# EasyEDA Pro project 遥控关灯接收(433).eprj

# Schematic Schematic1

## Sheets
1 电源: Create Date: 2022-12-05; Page Name: 电源; Project Name: 遥控关灯接收(433); Schematic Name: Schematic1; Update Date: 2022-12-05; Company: 嘉立创EDA; Page Size: A4; Version: V1.0
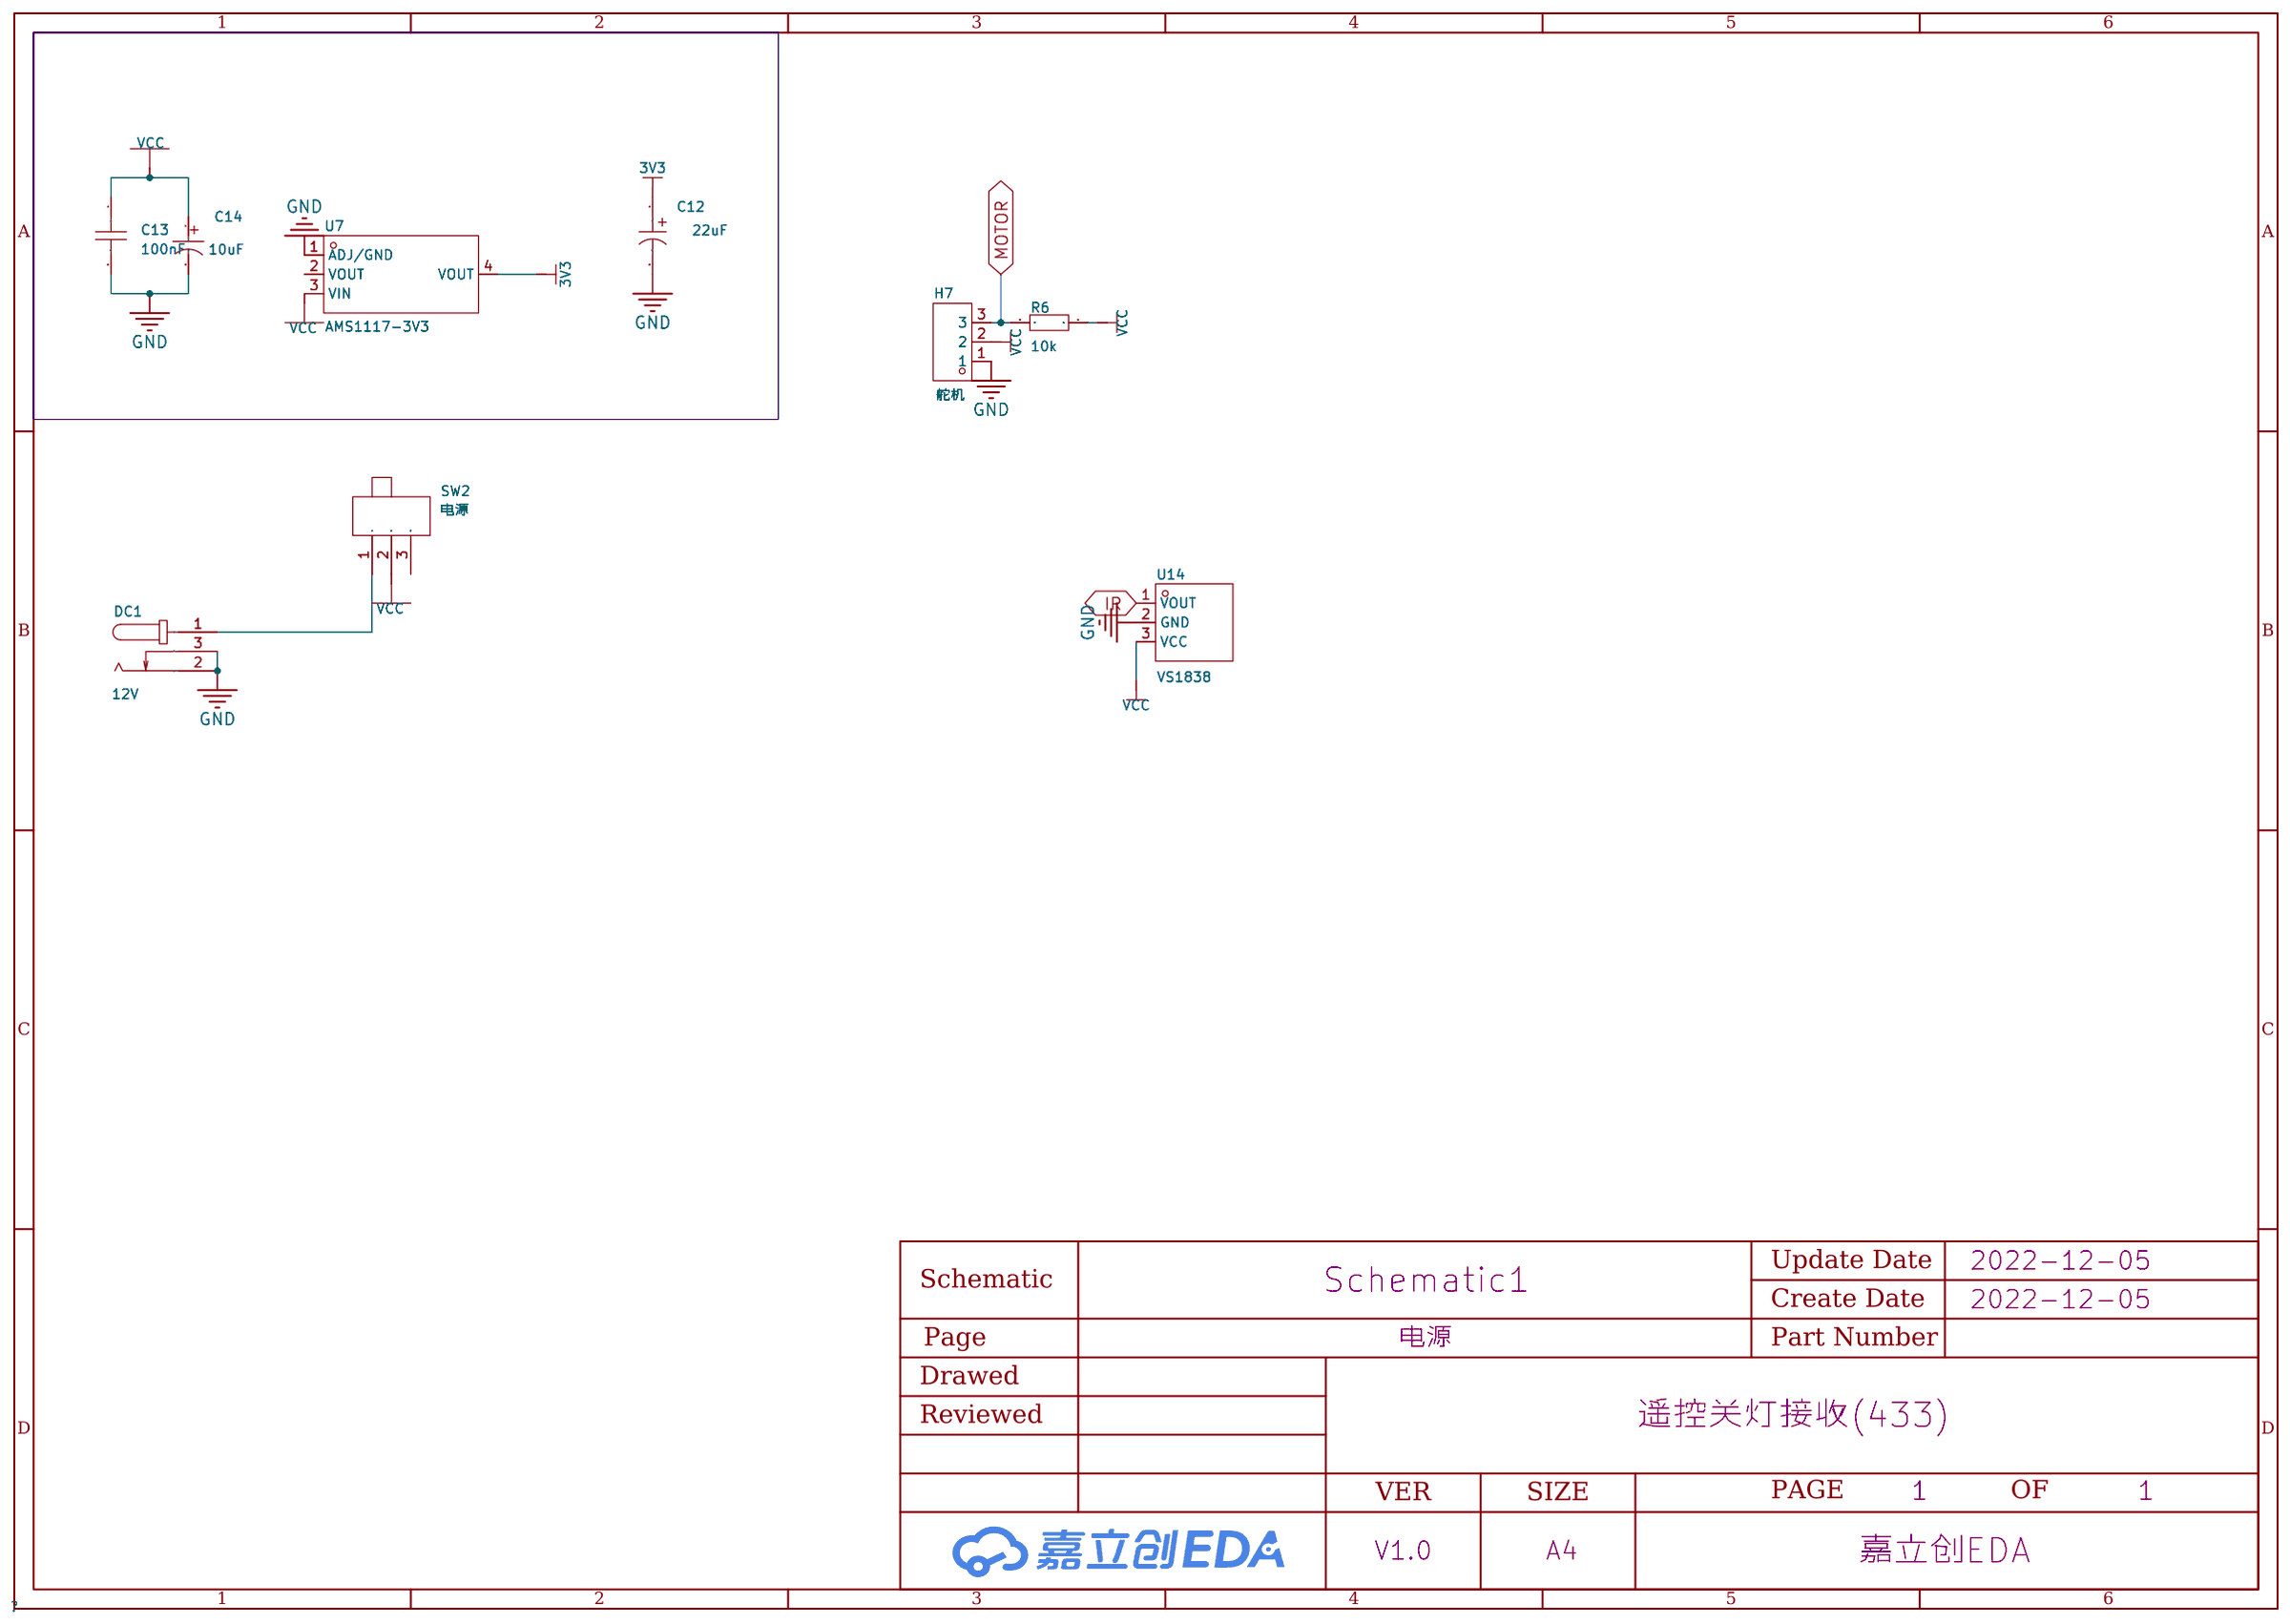
[diagram p0: 电源]
2 433接收: Page Name: 433接收
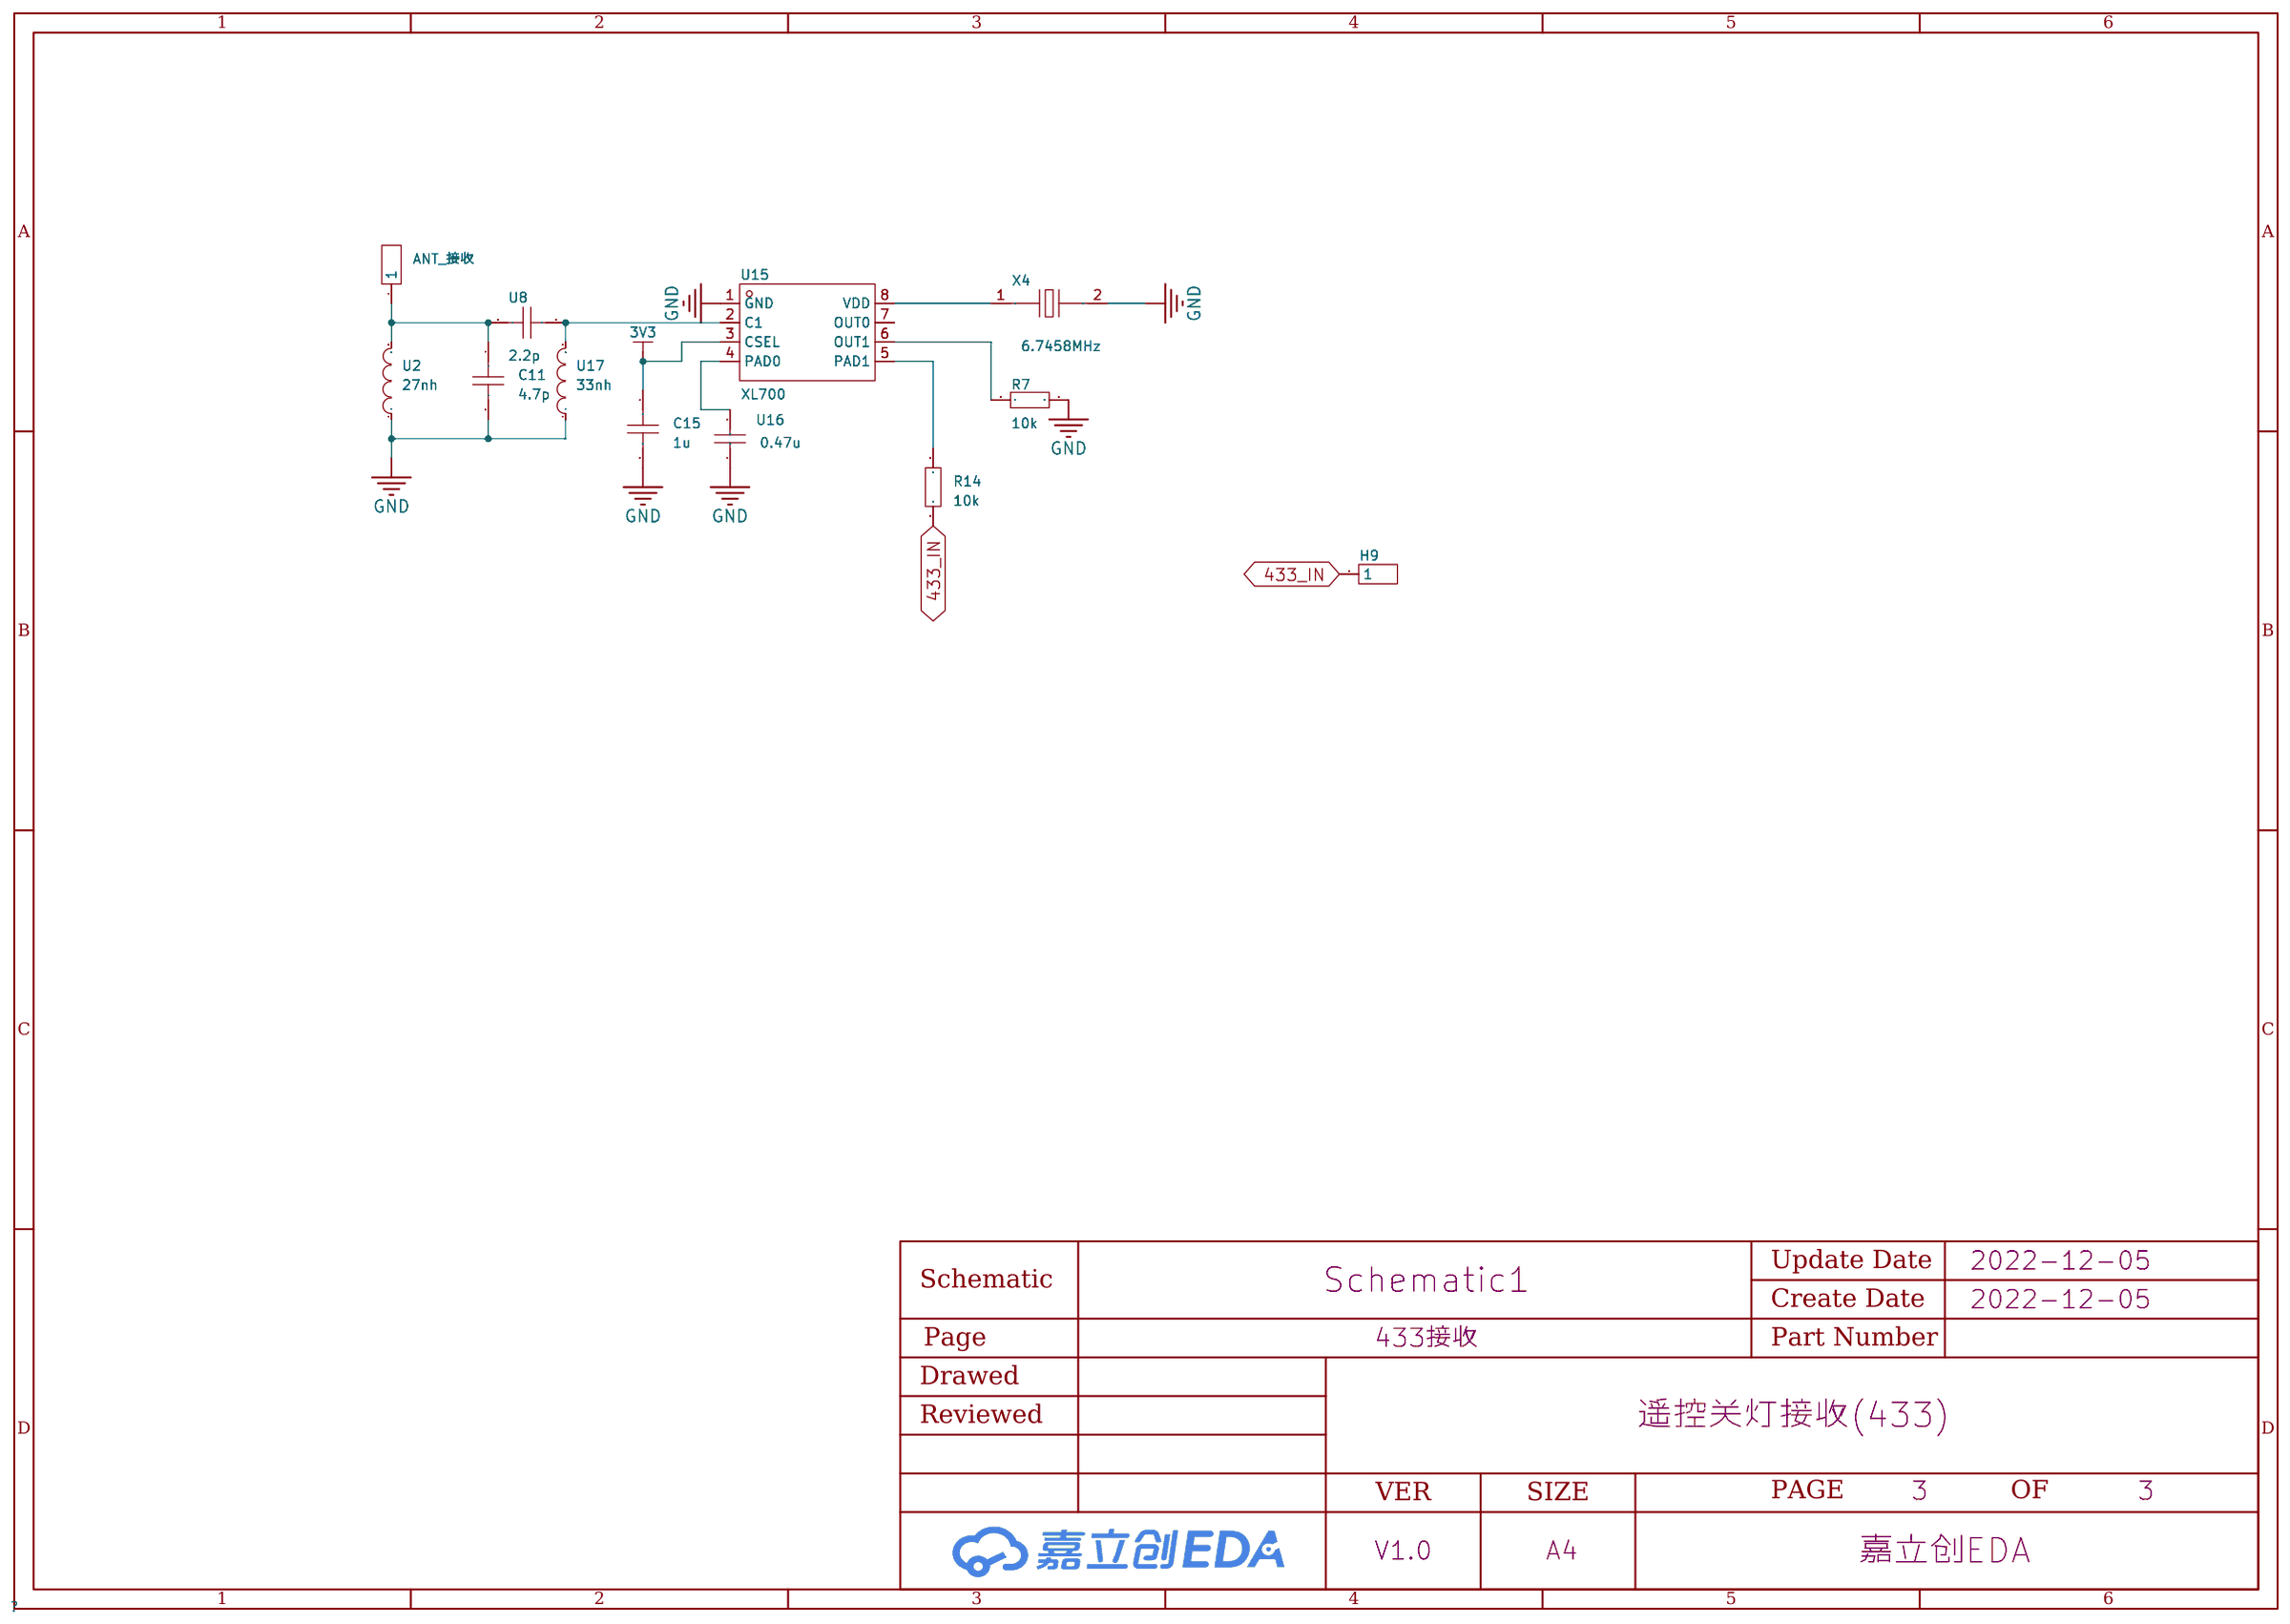
[diagram p1: 433接收]
3 stm32: Page Name: stm32
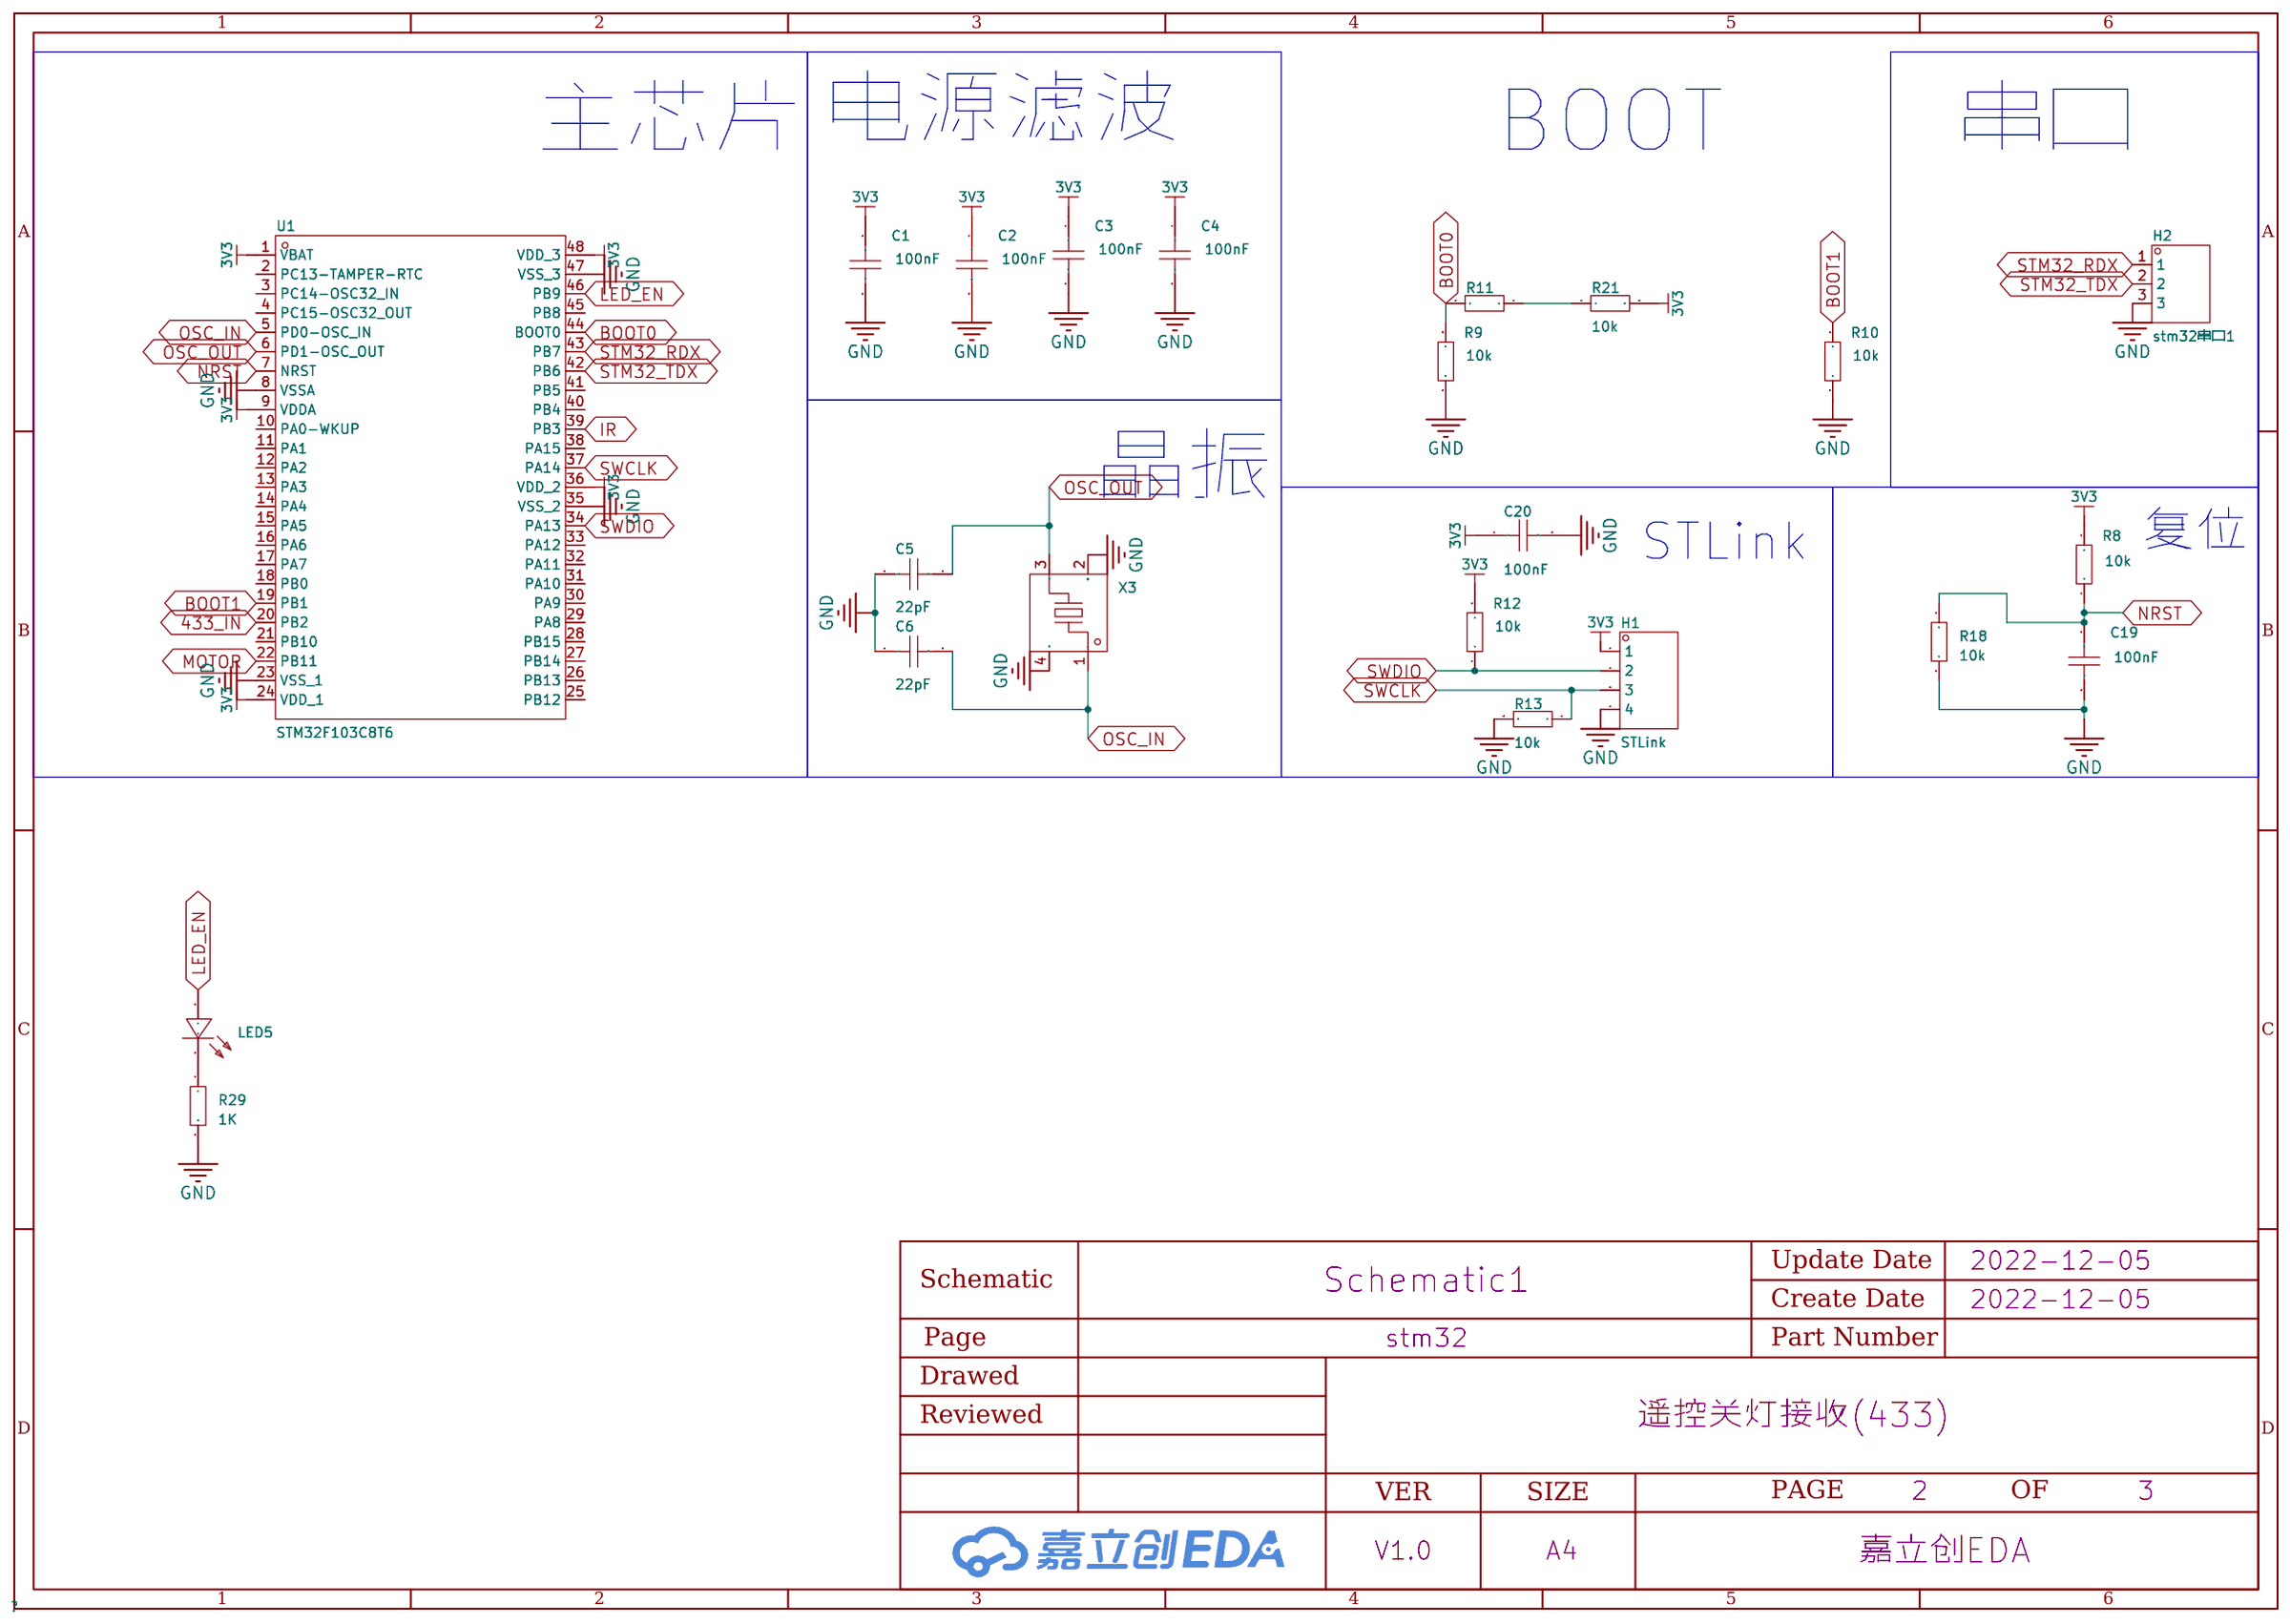
[diagram p2: stm32]

## Parts
sheet 433接收
ANT_接收  -  [HDR-TH_1P-V-M_XKB_X4611WV-01I-C28D40]
C11  4.7p  [C0805]
C15  1u  [C0805]
H9  -  [HDR-TH_1P-V-M_XKB_X4611WV-01I-C28D40]
R7  10k  [R0805]
R14  10k  [R0805]
U2  27nh  [L0603]
U8  2.2p  [C0603]
U15  XL700  [SOP-8_L4.9-W3.9-P1.27-LS6.0-BL]
U16  0.47u  [C0402]
U17  33nh  [L0603]
X4  -  [OSC-SMD_2P-L11.4-W4.7-LS12.3]
sheet stm32
C1  100nF  [C0805]
C2  100nF  [C0805]
C3  100nF  [C0805]
C4  100nF  [C0805]
C5  22pF  [C0805]
C6  22pF  [C0805]
C19  100nF  [C0805]
C20  100nF  [C0805]
H1  STLink  [HDR-TH_4P-P2.54-V-M]
H2  stm32串口1  [HDR-TH_3P-P2.54-V-M-1]
LED5  -  [LED0805-R-RD]
R8  10k  [R0805]
R9  10k  [R0805]
R10  10k  [R0805]
R11  100R  [R0805]
R12  10k  [R0805]
R13  10k  [R0805]
R18  10k  [R0805]
R21  10k  [R0805]
R29  1K  [R0805]
U1  STM32F103C8T6  [LQFP-48_L7.0-W7.0-P0.50-LS9.0-BL]
X3  NX3225SA-26MHz-STD-CSR-6  [CRYSTAL-SMD_4P-L3.2-W2.5-BL]
sheet 电源
C12  22uF  [CAP-TH_BD5.0-P2.00-D0.6-FD]
C13  100nF  [C0805]
C14  10uF  [CAP-TH_BD5.0-P2.00-D0.8-FD]
DC1  12V  [DC-IN-TH_DC005-T20]
H7  舵机  [HDR-TH_3P-P2.54-V-F]
R6  10k  [R0805]
SW2  电源  [SW-TH_MK-12D18-G040]
U7  AMS1117-3V3  [SOT-223-3_L6.7-W3.7-P2.30-LS7.0-BR]
U14  VS1838  [OPTO-TH_3P-L7.0-W5.6-P2.54-L]

## Library data of the parts
ANT_接收 H9 = HDR-M_2.54_1x1P: Supplier Part: C81276; Supplier Footprint: 插件; JLCPCB Part Class: Extended Part
C1-C6 C11 C13 C15 C19 C20 = 0805: Supplier Part: C9900012713; JLCPCB Part Class: Extended Part; Datasheet: https://atta.szlcsc.comnull; Supplier: LCSC
R6-R14 R18 R21 R29 = 0805: Supplier Part: C9900012715; JLCPCB Part Class: Extended Part; Datasheet: https://atta.szlcsc.comnull; Supplier: LCSC
U2 U17 = 1.3nH±10%: Supplier Part: C9900010244; JLCPCB Part Class: Extended Part; Datasheet: https://atta.szlcsc.comnull; Supplier: LCSC
U8 = 104P: Supplier Part: C9900009971; JLCPCB Part Class: Extended Part; Datasheet: https://atta.szlcsc.comnull; Supplier: LCSC
U15 = XW02E SOP8: 触摸芯片  XW02E SOP8 两通道触摸感应芯片 ,低功耗 强抗干扰 ；长按时间可达到30分钟； 可以抗ESD8000V 动态cs10v EFT4000V的测试 ；容易通过 EMC 测试; 唤醒时间0.2s，广泛应用于脱毛仪、铲皮刀等美容产品，筋膜枪，雾化器，加湿器，直饮机，水平仪 、咖啡机、 速热机等各类电源干扰大的产品-（不误动作）; LCSC Part Name: 触摸芯片; Supplier Part: C5156897; Manufacturer: Sam&wing(芯网); Supplier Footprint: SOP-8; Datasheet: https://atta.szlcsc.com/upload/public/pdf/source/20221018/6033144A9FF62F478D7EFEAD640D9693.pdf; Supplier: LCSC
U16 = 16p: Supplier Part: C9900003759; JLCPCB Part Class: Extended Part; Datasheet: https://atta.szlcsc.comnull; Supplier: LCSC
X4 = 49SMD-4MHZ-15PF-20PPM: 晶振类型:-;频率:-;负载电容:-;工作温度:-;; Supplier Part: C337676; Manufacturer: TKD(泰晶); Supplier Footprint: HC-49S-SMD-2P; JLCPCB Part Class: Extended Part; Datasheet: https://atta.szlcsc.com/upload/public/pdf/source/20190802/C337676_755A2B85AE73FBC05217DA61C6B0E5FE.pdf; Supplier: LCSC
H1 = B-2100S04P-A110: 间距:2.54mm;总PIN位数:4;排数:1;插针结构:1x4P;行距:-;安装类型:直插;圆针/方针:-;额定电流:-;额定电压:-;配合针长度:6mm;塑高:2.54mm;端接针长度:3mm;触头材质:黄铜;触头镀层:-;工作温度范围:-40~+105;颜色:黑色;; LCSC Part Name: 2.54mm 1x4P; Supplier Part: C124378; Manufacturer: Ckmtw(灿科盟); Supplier Footprint: 插件,P=2.54mm; JLCPCB Part Class: Extended Part; Datasheet: https://atta.szlcsc.com/upload/public/pdf/source/20170821/C124378_1503303307508901532.pdf; Supplier: LCSC; Pitch: 2.54mm; Number of Pins: 4; Number of Rows: 1; Pin Structure: 1x4P; Mounting Type: 直插; Length of Mating Pin: 6mm; Insulation Height: 2.54mm; Length of End Connection Pin: 3mm; Contact Material: 黄铜; Operating Temperature Range: -40~+105; Color: 黑色
H2 = 77311-102-03LF: 间距:2.54mm;总PIN位数:3;排数:1;插针结构:-;行距:-;安装类型:直插;圆针/方针:-;额定电流:-;额定电压:-;配合针长度:-;塑高:-;触头材质:磷青铜;触头镀层:-;颜色:黑色;; LCSC Part Name: 2.54mm; Supplier Part: C180248; Manufacturer: Amphenol; Supplier Footprint: 插件,P=2.54mm; JLCPCB Part Class: Extended Part; Datasheet: https://atta.szlcsc.com/upload/public/pdf/source/20180329/C180248_62E264527695F7ED58561BB828D45E42.pdf; Supplier: LCSC; Pitch: 2.54mm; Number of Pins: 3; Number of Rows: 1; Mounting Type: 直插; Contact Material: 磷青铜; Color: 黑色
LED5 = NCD0805G1: 发光颜色:翠绿;; LCSC Part Name: 翠绿; Supplier Part: C84260; Manufacturer: 国星光电; Supplier Footprint: 0805; JLCPCB Part Class: Extended Part; Datasheet: https://atta.szlcsc.com/upload/public/pdf/source/20200820/C84260_AFC7BF57C6FBA034D182BB8D10A67EFE.pdf; Supplier: LCSC; Emitted Color: 翠绿
U1 = STM32F103C8T6: CPU位数:32-Bit;ROM类型:FLASH;CPU内核:ARM® Cortex®-M3;主频（MAX):72MHz;工作电压:2V ~ 3.6V;; LCSC Part Name: STM32F103C8T6 MSL=3; Supplier Part: C8734; Manufacturer: ST(意法半导体); Supplier Footprint: LQFP-48_7x7x05P; JLCPCB Part Class: Basic Part; Datasheet: https://atta.szlcsc.com/upload/public/pdf/source/20140724/1457707174202.pdf; Supplier: LCSC; Core Size: 32-Bit; Program Memory Type: FLASH; Core Processor: ARM® Cortex®-M3; Speed: 72MHz; Voltage - Supply (Vcc/Vdd): 2V ~ 3.6V; Program Memory Size: 64KB; RAM Size: 20KB; Number of I/O: 37; A/D: 10x12bit; D/A: 0; PWM: 13; LCD: 0; UART/USART: 3 USART; SPI: 2; I2C（SMBUS/PMBUS）: 2; USB Device: 1; CAN: 1; Ethernet: 0
X3 = NX3225SA-26MHz-STD-CSR-6: LCSC Part Name: NX3225SA 26MHz 8pF ±15ppm ?40 to +85 °C; Supplier Part: C880099; Manufacturer: NDK; Supplier Footprint: 3225; JLCPCB Part Class: Extended Part; Datasheet: https://atta.szlcsc.com/upload/public/pdf/source/20171201/C156252_15121213466341157580.pdf; Supplier: LCSC
C12 = LW220M0500511PV2-D5: LCSC Part Name: 22uF 50V; Supplier Part: C2847230; Manufacturer: UNITED(怡德); Supplier Footprint: 径向引线,5x11mm; JLCPCB Part Class: Extended Part; Datasheet: https://atta.szlcsc.com/upload/public/pdf/source/20210723/C2847230_6E41DE0F8E72341694F7D9843C90A4AD.pdf; Supplier: LCSC
C14 = KM106M025D11RR0VH2FP0: 脚间距:2mm;额定电压:25V;纹波电流:38mA 120Hz;等效串联电阻:-;精度:±20%;电容体直径:5mm;工作温度:-;电容体长度:11mm;容值:10uF;工作寿命:1000hrs 105;; LCSC Part Name: 10uF 25V; Supplier Part: C43347; Manufacturer: CX(承兴); Supplier Footprint: 径向引线,5x11mm; JLCPCB Part Class: Extended Part; Datasheet: https://atta.szlcsc.com/upload/public/pdf/source/20151029/1457707524171.pdf; Supplier: LCSC; Lead Spacing: 2mm; Rated Voltage: 25V; Ripple Current: 38mA 120Hz; Tolerance: ±20%; φD: 5mm; L: 11mm; Lifetime @ Temp: 1000hrs 105
DC1 = DC005-T20: 连接器类型:DC电源插座;安装方式:弯插;触点内径:-;触点外径:6.3mm;额定电流:3A;额定电压:30V;工作温度范围:-10~+60;; LCSC Part Name: 外径:6.3mm B级 全铜; Supplier Part: C111567; Manufacturer: SOFNG(硕方); Supplier Footprint: 插件; JLCPCB Part Class: Extended Part; Datasheet: https://atta.szlcsc.com/upload/public/pdf/source/20170519/1495157966733.pdf; Supplier: LCSC; Connector Type: DC电源插座; Mounting Style: 弯插; Outside Contact Diameter: 6.3mm; Current Rating (Max): 3A; Voltage Rating (Max): 30V; Operating Temperature Range: -10~+60
H7 = HDR-F_2.54_1x3P: Supplier Part: C541850; Supplier Footprint: 插件
SW2 = MK-12D18-G020: LCSC Part Name: 边三脚微型拨动开关G4; Supplier Part: C3019727; Manufacturer: G-Switch(品赞); Supplier Footprint: 插件; JLCPCB Part Class: Extended Part; Datasheet: https://atta.szlcsc.com/upload/public/pdf/source/20201201/C963202_825FB742C5BA766BED52E1DDA96DE5A3.pdf; Supplier: LCSC
U7 = AMS1117-5.0: 静态电流(Iq):-;输出类型:固定;最大输入电压:18V;输出电压(可调):-;压降(max):1.5V @ 1A;输出电压(固定):5V;; Supplier Part: C473812; Manufacturer: Slkor(萨科微); Supplier Footprint: SOT-223; JLCPCB Part Class: Extended Part; Datasheet: https://atta.szlcsc.com/upload/public/pdf/source/20201231/C426566_7F22DB93439D00F3FA27143E4F28C6AA.pdf; Supplier: LCSC; Output Configuration: 正; Current - Supply (Max): 5mA; Output Current (Max): 1.4A; Output Type: 固定; Number of Output Channels: 1; Voltage - Input (Max): 18V; Operating Temperature: -40~85; Voltage Dropout (Max): 1.5V @ 1A; Voltage - Output (Fixed): 5V
U14 = DY-IRM-AC01-AN: LCSC Part Name: 38K解码接收头; Supplier Part: C2759912; Manufacturer: TONYU(东裕); Supplier Footprint: 插件; JLCPCB Part Class: Extended Part; Datasheet: https://atta.szlcsc.com/upload/public/pdf/source/20210319/C2759912_32410E2E7FB9BD2506BF27C3C0537725.pdf; Supplier: LCSC

## Nets
3V3: C1.1 C2.1 C3.1 C4.1 C12.1 C15.1 C20.1 H1.1 R8.2 R12.2 R21.2 U1.1(VBAT) U1.9(VDDA) U1.24(VDD_1) U1.36(VDD_2) U1.48(VDD_3) U7.4(VOUT) U15.3(CSEL)
GND: C1.2 C2.2 C3.2 C4.2 C5.1 C6.1 C11.2 C12.2 C13.2 C14.2 C15.2 C19.2 C20.2 DC1.2 DC1.3 H1.4 H2.3 H7.1 R7.1 R9.1 R10.1 R13.2 R18.2 R29.2 U1.8(VSSA) U1.23(VSS_1) U1.35(VSS_2) U1.47(VSS_3) U2.1 U7.1(ADJ/GND) U14.2(GND) U15.1(GND) U16.1 U17.1 X3.2(GND) X3.4(GND) X4.2
VCC: C13.1 C14.1 H7.2 R6.1 SW2.2 U7.3(VIN) U14.3(VCC)
433_IN: H9.1 R14.2 U1.20(PB2)
BOOT0: R9.2 R11.2 U1.44(BOOT0)
BOOT1: R10.2 U1.19(PB1)
IR: U1.39(PB3) U14.1(VOUT)
LED_EN: LED5.1(A) U1.46(PB9)
MOTOR: H7.3 R6.2 U1.22(PB11)
NRST: C19.1 R8.1 R18.1 U1.7(NRST)
OSC_IN: C6.2 U1.5(PD0-OSC_IN) X3.1
OSC_OUT: C5.2 U1.6(PD1-OSC_OUT) X3.3
STM32_RDX: H2.1 U1.43(PB7)
STM32_TDX: H2.2 U1.42(PB6)
SWCLK: H1.3 R13.1 U1.37(PA14)
SWDIO: H1.2 R12.1 U1.34(PA13)
$1N824: DC1.1 SW2.1
$2N627: ANT_接收.1 C11.1 U2.2 U8.2
$2N630: U8.1 U15.2(C1) U17.2
$2N631: U15.8(VDD) X4.1
$2N635: R7.2 U15.6(OUT1)
$2N636: R14.1 U15.5(PAD1)
$2N638: U15.4(PAD0) U16.2
$3N3616: LED5.2(K) R29.1
Net-(R11-1): R11.1 R21.1

Not connected (* = marked no-connect by the designer): SW2 3; U1 2(PC13-TAMPER-RTC) 3(PC14-OSC32_IN) 4(PC15-OSC32_OUT) 10(PA0-WKUP) 11(PA1) 12(PA2) 13(PA3) 14(PA4) 15(PA5) 16(PA6) 17(PA7) 18(PB0) 21(PB10) 25(PB12) 26(PB13) 27(PB14) 28(PB15) 29(PA8) 30(PA9) 31(PA10) 32(PA11) 33(PA12) 38(PA15) 40(PB4) 41(PB5) 45(PB8); U7 2(VOUT); U15 7(OUT0)

## Notes on the sheets
sheet 3
- 主芯片
- 电源滤波
- BOOT
- 串口
- 晶振
- STLink
- 复位

# Board PCB1
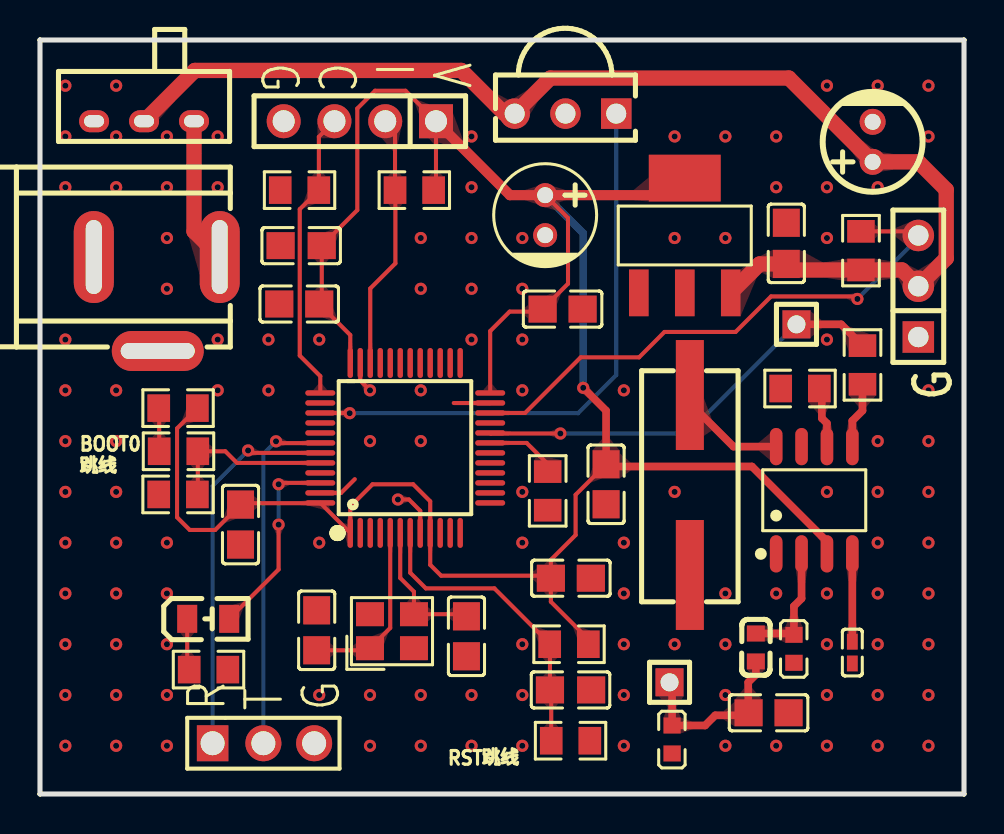
[diagram p3: board, top side]
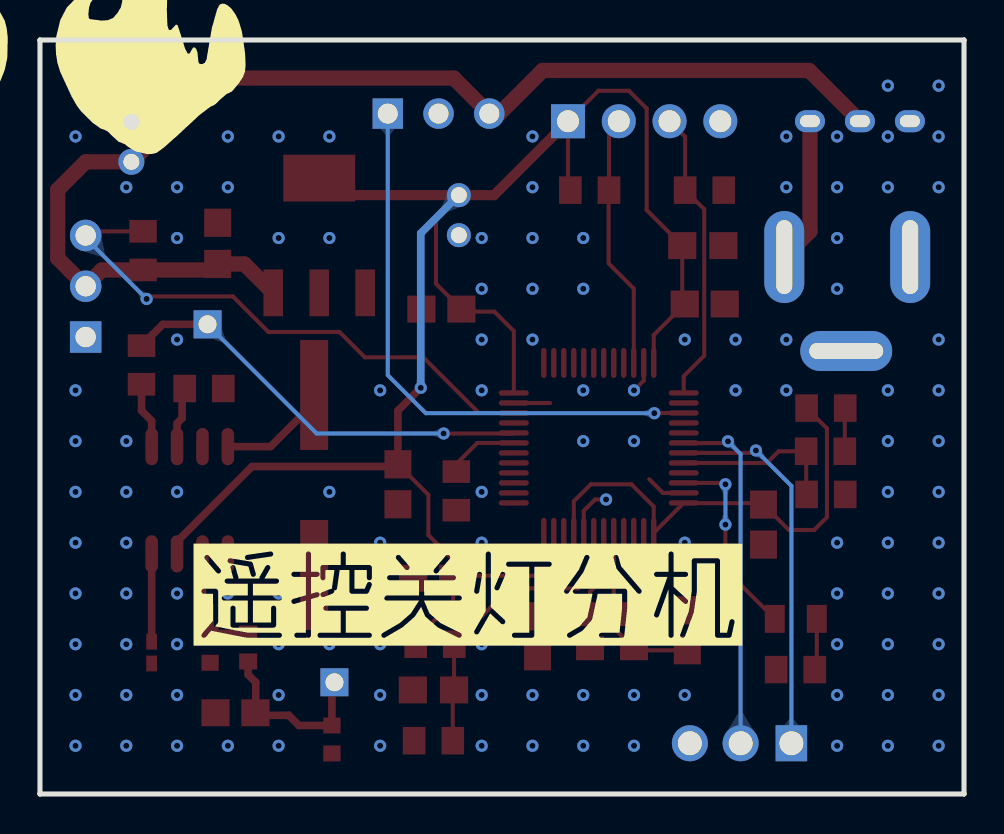
[diagram p4: board, bottom side, seen from below]

Outline 46.23 x 37.72 mm; copper layers: Top Layer, Bottom Layer. Coordinates in mm from the lower left corner of the outline.
Outline path: 0,37.71 0,0 arc(0,0) 0,0 46.22,0 arc(46.23,0) 46.23,0 46.23,37.71 arc(46.23,37.72) 46.22,37.72 0,37.72 arc(0,37.72) 0,37.71
Stack: Top Layer 0.035mm / Dielectric1 1.51mm FR4 er 4.5 / Bottom Layer 0.035mm

## Design rules (mm)
spacing safeClearance (default): track to track 0.152, other pairs 0.152 to 0.3
track width trackWidth (default): min 0.127, default 0.254, max 2.54
differential pair differentialPair (default): width min 0.127, default 0.254, max 2.54; gap min 0.152, default 0.152
via viaSize (default): diameter min 0.5, default 0.61, max 10; hole min 0.3, default 0.305, max 6

## Placement (name value [footprint] x y rotation side)
ANT_接收  -  [HDR-TH_1P-V-M_XKB_X4611WV-01I-C28D40]  31.5 5.59 270 top
BOOT0
跳线  -  [R0805]  6.93 17.14 0 top
C1  100nF  [C0805]  12.97 24.51 180 top
C2  100nF  [C0805]  26.56 10.8 0 top
C3  100nF  [C0805]  26.15 24.26 0 top
C4  100nF  [C0805]  10.03 13.48 270 top
C5  22pF  [C0805]  21.34 7.89 90 top
C6  22pF  [C0805]  13.84 8.19 270 top
C11  4.7p  [C0805]  36.45 4.06 0 top
C12  22uF  [CAP-TH_BD5.0-P2.00-D0.6-FD]  25.27 28.96 270 top
C13  100nF  [C0805]  37.34 27.55 90 top
C14  10uF  [CAP-TH_BD5.0-P2.00-D0.8-FD]  41.66 32.62 90 top
C15  1u  [C0805]  28.32 15.49 270 top
C19  100nF  [C0805]  26.54 5.21 0 top
C20  100nF  [C0805]  13.07 27.43 180 top
DC1  12V  [DC-IN-TH_DC005-T20]  5.84 24.51 0 top
H1  STLink  [HDR-TH_4P-P2.54-V-M]  16 33.66 180 top
H2  stm32串口1  [HDR-TH_3P-P2.54-V-M-1]  11.18 2.54 0 top
H7  舵机  [HDR-TH_3P-P2.54-V-F]  43.94 25.4 90 top
H9  -  [HDR-TH_1P-V-M_XKB_X4611WV-01I-C28D40]  37.85 23.5 270 top
LED5  -  [LED0805-R-RD]  8.42 8.76 0 top
R6  10k  [R0805]  41.07 27.18 90 top
R7  10k  [R0805]  38.02 20.28 0 top
R8  10k  [R0805]  26.47 7.49 0 top
R9  10k  [R0805]  6.91 14.99 0 top
R10  10k  [R0805]  25.4 15.16 90 top
R12  10k  [R0805]  18.73 30.21 0 top
R13  10k  [R0805]  12.99 30.21 180 top
R14  10k  [R0805]  41.15 21.46 90 top
R21  10k  [R0805]  6.91 19.3 0 top
R29  1K  [R0805]  8.43 6.22 0 top
RST跳线  -  [R0805]  26.54 2.67 0 top
SW2  电源  [SW-TH_MK-12D18-G040]  5.21 33.66 180 top
U1  STM32F103C8T6  [LQFP-48_L7.0-W7.0-P0.50-LS9.0-BL]  18.27 17.31 0 top
U2  27nh  [L0603]  31.62 2.73 90 top
U7  AMS1117-3V3  [SOT-223-3_L6.7-W3.7-P2.30-LS7.0-BR]  32.26 27.94 270 top
U8  2.2p  [C0603]  35.81 7.33 270 top
U14  VS1838  [OPTO-TH_3P-L7.0-W5.6-P2.54-L]  26.29 34.04 180 top
U15  XL700  [SOP-8_L4.9-W3.9-P1.27-LS6.0-BL]  38.73 14.7 0 top
U16  0.47u  [C0402]  40.64 7.08 90 top
U17  33nh  [L0603]  37.72 7.27 90 top
X3  NX3225SA-26MHz-STD-CSR-6  [CRYSTAL-SMD_4P-L3.2-W2.5-BL]  17.61 8.14 0 top
X4  -  [OSC-SMD_2P-L11.4-W4.7-LS12.3]  32.51 15.46 270 top

## Footprints (pads in the part's own frame, mm; a bottom-side part is the same pattern mirrored in y, then rotated)
C0402
  rect 0.79x0.54 smd: 1(-0.545,0) 2(0.545,0)
C0603
  rect 0.8x0.9 smd: 1(-0.7,0) 2(0.7,0)
C0805
  rect 1.41x1.35 smd: 1(-1.03,0) 2(1.03,0)
CAP-TH_BD5.0-P2.00-D0.6-FD
  round 1.202 hole 0.8: 1(-1.001,0) 2(1.001,0)
CAP-TH_BD5.0-P2.00-D0.8-FD
  round 1.3 hole 0.8: 1(-1.001,0) 2(1.001,0)
CRYSTAL-SMD_4P-L3.2-W2.5-BL
  rect 1.4x1.2 smd: 1(-1.1,-0.85) 2(1.1,-0.85) 3(1.1,0.85) 4(-1.1,0.85)
DC-IN-TH_DC005-T20
  oval 1.999x4.6 hole 0.8x3.701: 1(3.15,2.349) 2(-3.15,2.349)
  oval 4.6x1.999 hole 3.701x0.8: 3(0.051,-2.349)
HDR-TH_1P-V-M_XKB_X4611WV-01I-C28D40
  rect 1.399x1.399 hole 0.899: 1(0,0)
HDR-TH_3P-P2.54-V-F
  rect 1.575x1.575 hole 1.02: 1(-2.54,0)
  round 1.575 hole 1.02: 2(0,0) 3(2.54,0)
HDR-TH_3P-P2.54-V-M-1
  rect 1.575x1.801 hole 1.199: 1(-2.54,0)
  round 1.801 hole 1.199: 2(0,0) 3(2.54,0)
HDR-TH_4P-P2.54-V-M
  rect 1.7x1.7 hole 1.1: 1(-3.81,0)
  round 1.7 hole 1.1: 2(-1.27,0) 3(1.27,0) 4(3.81,0)
L0603
  rect 0.8x0.864 smd: 1(-0.7,0) 2(0.7,0)
LED0805-R-RD
  rect 1x1.399 smd: 1(1.05,0) 2(-1.05,0)
LQFP-48_L7.0-W7.0-P0.50-LS9.0-BL
  oval 0.27x1.5 smd: 1(-2.75,-4.25) 2(-2.25,-4.25) 3(-1.75,-4.25) 4(-1.25,-4.25) 5(-0.75,-4.25) 6(-0.25,-4.25) 7(0.25,-4.25) 8(0.75,-4.25) 9(1.25,-4.25) 10(1.75,-4.25) 11(2.25,-4.25) 12(2.75,-4.25) 25(2.75,4.25) 26(2.25,4.25) 27(1.75,4.25) 28(1.25,4.25) 29(0.75,4.25) 30(0.25,4.25) 31(-0.25,4.25) 32(-0.75,4.25) 33(-1.25,4.25) 34(-1.75,4.25) 35(-2.25,4.25) 36(-2.75,4.25)
  oval 1.5x0.27 smd: 13(4.25,-2.75) 14(4.25,-2.25) 15(4.25,-1.75) 16(4.25,-1.25) 17(4.25,-0.75) 18(4.25,-0.25) 19(4.25,0.25) 20(4.25,0.75) 21(4.25,1.25) 22(4.25,1.75) 23(4.25,2.25) 24(4.25,2.75) 37(-4.25,2.75) 38(-4.25,2.25) 39(-4.25,1.75) 40(-4.25,1.25) 41(-4.25,0.75) 42(-4.25,0.25) 43(-4.25,-0.25) 44(-4.25,-0.75) 45(-4.25,-1.25) 46(-4.25,-1.75) 47(-4.25,-2.25) 48(-4.25,-2.75)
OPTO-TH_3P-L7.0-W5.6-P2.54-L
  rect 1.524x1.524 hole 1.001: 1(-2.54,0)
  round 1.524 hole 1.001: 2(0,0) 3(2.54,0)
OSC-SMD_2P-L11.4-W4.7-LS12.3
  rect 5.499x1.399 smd: 1(-4.501,0) 2(4.501,0)
R0805
  rect 1.133x1.377 smd: 1(-0.966,0) 2(0.966,0)
SOP-8_L4.9-W3.9-P1.27-LS6.0-BL
  oval 0.63x1.865 smd: 1(-1.905,-2.683) 2(-0.635,-2.683) 3(0.635,-2.683) 4(1.905,-2.683) 5(1.905,2.683) 6(0.635,2.683) 7(-0.635,2.683) 8(-1.905,2.683)
SOT-223-3_L6.7-W3.7-P2.30-LS7.0-BR
  rect 2.34x0.98 smd: 1(2.87,-2.3) 2(2.87,0) 3(2.87,2.3)
  rect 2.34x3.6 smd: 4(-2.87,0)
SW-TH_MK-12D18-G040
  oval 1.5x1.1 hole 1x0.6: 1(-2.5,0) 2(0,0) 3(2.5,0)

## Nets
As in the schematic, except:
GND: C1.2 C2.2 C3.2 C4.2 C5.1 C6.1 C11.2 C12.2 C13.2 C14.2 C15.2 C19.2 C20.2 DC1.2 DC1.3 H1.4 H2.3 H7.1 R7.1 R9.1 R10.1 R13.2 R29.2 RST跳线.2 U1.8 U1.23 U1.35 U1.47 U2.1 U7.1 U14.2 U15.1 U16.1 U17.1 X3.2 X3.4 X4.2
BOOT0: BOOT0
跳线.2 R9.2 U1.44
NRST: C19.1 R8.1 RST跳线.1 U1.7
$3N3628: BOOT0
跳线.1 R21.1

Pads without a net: SW2 3; U1 2 3 4 10 11 12 13 14 15 16 17 18 21 25 26 27 28 29 30 31 32 33 38 40 41 45; U7 2; U15 7

## Via types
v1: diameter 0.61, hole 0.305, Top Layer to Bottom Layer, 129 vias

## Routing (per net, layer and track width the routed paths; a pad name or vN(x,y) marks a point on that pad's centre or on a via; arc(x,y) is an arc through that point)
3V3: length 120.3
  Top Layer w0.203: R21.2 6.86,18.29 6.86,13.84 7.49,13.21 8.76,13.21 C4.1 10.1,14.55 14.01,14.55 U1.48 U1.1 15.52,14.38 16.64,15.49 18.67,15.49 19.52,14.64 U1.9 19.52,11.47 20.07,10.92 25.43,10.92 C2.1 ; C2.1 25.56,11.72 26.8,12.95 26.8,14.97 C15.1 ; C2.1 25.56,9.62 27.43,7.75 R8.2 ; U1.36 15.52,22.96 C1.1 14.1,24.64 C20.1 15.88,29.21 15.88,34.29 16.76,35.18 18.29,35.18 H1.1 19.81,30.33 R12.2 ; C12.1 26.42,28.81 26.42,25.53 C3.1 25.02,24.13 23.5,24.13 22.52,23.16 U1.24
  Top Layer w0.381: v1(27.18,20.32) 28.32,19.18 C15.1 28.43,16.38 35.62,16.38 39.37,12.63 39.37,12.01
  Top Layer w0.508: U7.4 31.41,29.96 C12.1 23.51,29.96 H1.1
  Bottom Layer w0.381: v1(27.18,20.32) 27.18,28.05 C12.1
GND: length 7.9
  Top Layer w0.203: v1(16.51,20.19) 16.02,20.68 U1.35 ; U1.47 15.06,15.06 15.75,15.75 ; U1.23 22.52,19.56 20.7,19.56 ; U1.8 19.02,14.17 18.46,14.73 v1(17.91,14.73)
  vias: v1(1.27,35.43) v1(1.27,32.89) v1(1.27,30.35) v1(1.27,22.73) v1(1.27,20.19) v1(1.27,17.65) v1(1.27,15.11) v1(1.27,12.57) v1(1.27,10.03) v1(1.27,7.49) v1(1.27,4.95) v1(1.27,2.41) v1(3.81,35.43) v1(3.81,32.89) v1(3.81,30.35) v1(3.81,20.19) v1(3.81,17.65) v1(3.81,15.11) v1(3.81,12.57) v1(3.81,10.03) v1(3.81,7.49) v1(3.81,4.95) v1(3.81,2.41) v1(6.35,32.89) v1(6.35,30.35) v1(6.35,27.81) v1(6.35,25.27) v1(6.35,12.57) v1(6.35,10.03) v1(6.35,7.49) v1(6.35,4.95) v1(6.35,2.41) v1(8.89,32.89) v1(8.89,30.35) v1(8.89,22.73) v1(8.89,20.19) v1(11.43,22.73) v1(11.43,20.19) v1(13.97,22.73) v1(13.97,12.57) v1(13.97,4.95) v1(16.51,17.65) v1(16.51,4.95) v1(16.51,2.41) v1(19.05,27.81) v1(19.05,25.27) v1(19.05,20.19) v1(19.05,17.65) v1(19.05,4.95) v1(19.05,2.41) v1(21.59,32.89) v1(21.59,30.35) v1(21.59,27.81) v1(21.59,25.27) v1(21.59,22.73) v1(21.59,4.95) v1(21.59,2.41) v1(24.13,27.81) v1(24.13,25.27) v1(24.13,22.73) v1(24.13,20.19) v1(24.13,15.11) v1(24.13,12.57) v1(24.13,7.49) v1(24.13,4.95) v1(24.13,2.41) v1(29.21,20.19) v1(29.21,12.57) v1(29.21,10.03) v1(29.21,7.49) v1(29.21,4.95) v1(29.21,2.41) v1(31.75,32.89) v1(31.75,27.81) v1(31.75,15.11) v1(31.75,7.49) v1(34.29,32.89) v1(34.29,27.81) v1(34.29,10.03) v1(34.29,7.49) v1(34.29,4.95) v1(34.29,2.41) v1(36.83,32.89) v1(36.83,30.35) v1(36.83,10.03) v1(36.83,2.41) v1(39.37,35.43) v1(39.37,30.35) v1(39.37,27.81) v1(39.37,22.73) v1(39.37,15.11) v1(39.37,10.03) v1(39.37,7.49) v1(39.37,4.95) v1(39.37,2.41) v1(41.91,35.43) v1(41.91,30.35) v1(41.91,17.65) v1(41.91,15.11) v1(41.91,12.57) v1(41.91,10.03) v1(41.91,7.49) v1(41.91,4.95) v1(41.91,2.41) v1(44.45,35.43) v1(44.45,32.89) v1(44.45,20.19) v1(44.45,17.65) v1(44.45,15.11) v1(44.45,12.57) v1(44.45,10.03) v1(44.45,7.49) v1(44.45,4.95) v1(44.45,2.41)
VCC: length 61
  Top Layer w0.762: U7.3 36,26.52 C13.1 37.64,26.21 R6.1 43.13,26.21 H7.2 45.34,26.8 45.34,30.23 43.94,31.62 v1(41.66,31.62) 37.47,35.81 25.53,35.81 U14.3 23.24,34.04 21.08,36.2 7.75,36.2 SW2.2
433_IN: length 21.3
  Top Layer w0.203: U1.20 22.55,18.03 v1(26.03,18.03)
  Top Layer w0.381: v1(37.85,23.5) 40.08,23.5 41.15,22.43
  Bottom Layer w0.203: v1(37.85,23.5) 32.38,18.03 v1(26.03,18.03)
BOOT0: length 8.5
  Top Layer w0.203: U1.44 9.85,16.56 9.27,17.14 BOOT0
跳线.2 7.9,15.01 R9.2
BOOT1: length 3.7
  Top Layer w0.203: 25.4,16.13 25.4,16.51 24.35,17.56 U1.19
IR: length 28.7
  Top Layer w0.203: v1(15.49,19.05) 15.48,19.06 U1.39
  Bottom Layer w0.203: U14.1 28.83,20.95 26.92,19.05 v1(15.49,19.05)
LED_EN: length 9.9
  Top Layer w0.203: U1.46 12.01,15.56 v1(11.94,15.49) ; LED5.1 11.94,11.23 v1(11.94,13.48)
  Bottom Layer w0.203: 11.94,13.48 v1(11.94,15.49)
MOTOR: length 28.2
  Top Layer w0.203: v1(43.94,27.94) 43.74,28.15 R6.2 ; U1.22 24.27,19.06 27.05,21.84 29.97,21.84 31.24,23.11 34.8,23.11 36.58,24.89 40.77,24.89 v1(40.89,24.77)
  Bottom Layer w0.203: v1(40.89,24.77) 43.94,27.81 v1(43.94,27.94)
NRST: length 15.3
  Top Layer w0.203: U1.7 18.52,11.07 19.3,10.29 22.73,10.29 25.5,7.52 R8.1 25.51,7.48 C19.1 25.58,5.14 RST跳线.1
OSC_IN: length 8.9
  Top Layer w0.203: U1.5 17.52,8.31 X3.1 16.41,7.19 C6.2
OSC_OUT: length 7
  Top Layer w0.203: U1.6 18.02,10.81 18.71,10.12 X3.3 21.23,9 C5.2
STM32_RDX: length 19
  Top Layer w0.203: U1.43 10.53,17.06 v1(10.41,17.19)
  Bottom Layer w0.203: v1(10.41,17.19) 8.64,15.41 v1(8.64,2.54)
STM32_TDX: length 17.6
  Top Layer w0.203: v1(11.81,17.64) 11.82,17.64 11.91,17.56 14.02,17.56 U1.42
  Bottom Layer w0.203: v1(11.18,2.54) 11.18,17.01 v1(11.81,17.64)
SWCLK: length 14.7
  Top Layer w0.203: H1.3 13.95,32.88 R13.1 13,29.25 13,21.93 14.02,20.9 U1.37
SWDIO: length 12.8
  Top Layer w0.203: U1.34 16.52,25.29 17.78,26.54 17.78,30.19 17.76,30.21 17.76,33.17 H1.2
$1N824: length 7.3
  Top Layer w0.762: DC1.1 7.71,28.14 SW2.1
$2N627: length 9
  Top Layer w0.381: U8.2 35.81,5.97 35.43,5.59 35.43,4.08 C11.1 35.32,3.94 33.78,3.94 33.27,3.43 U2.2 31.62,5.46 ANT_接收.1
$2N630: length 6.1
  Top Layer w0.381: U8.1 37.65,8.03 U17.2 37.72,9.4 38.1,9.78 U15.2
$2N631: length 5.6
  Top Layer w0.381: X4.1 32.51,19.56 34.69,17.38 U15.8
$2N635: length 3.1
  Top Layer w0.381: 39.37,17.38 39.37,18.54 39.12,18.8 39.12,20.16 R7.2
$2N636: length 3.3
  Top Layer w0.381: R14.1 41.15,19.18 40.64,18.67 U15.5
$2N638: length 4.4
  Top Layer w0.381: 40.64,7.66 U15.4
$3N3616: length 2.6
  Top Layer w0.203: LED5.2 7.37,6.32 7.47,6.22
$3N3628: length 2.2
  Top Layer w0.203: BOOT0
跳线.1 5.96,19.28 5.94,19.3

## Copper pours and planes (outline as drawn; the poured copper is in the pictures)
GND on Top Layer: -6.35,41.28 55.25,41.28 55.25,-10.29 -6.35,-10.29
GND on Bottom Layer: -5.97,42.04 54.86,42.04 54.86,-2.79 -5.97,-2.79

Small or netless copper shapes (teardrops, artwork), in the pictures only: 124 on Top Layer, 18 on Bottom Layer

## Text on the board
Bottom Silkscreen Layer: 遥控关灯分机
Top Silkscreen Layer: R / T / G | V / I / C / G | G
